# Altium schematic sheet Output-Connectors.SchDoc
size A
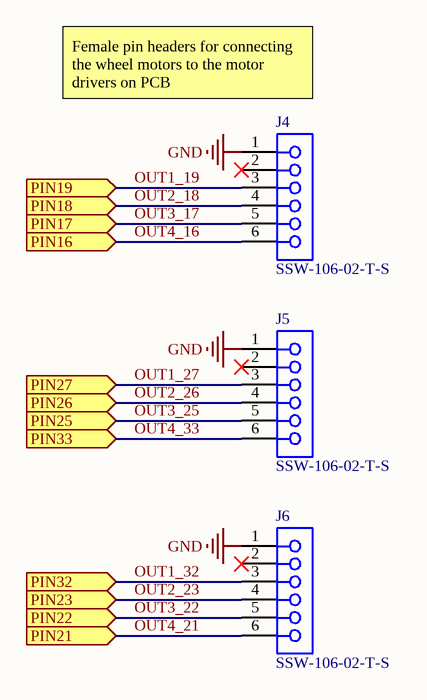
[diagram p0: Output-Connectors.SchDoc]

## Parts
J4  SSW-106-02-T-S  [SMTC-SSW-106-02-X-S]
J5  SSW-106-02-T-S  [SMTC-SSW-106-02-X-S]
J6  SSW-106-02-T-S  [SMTC-SSW-106-02-X-S]

## Ports
PIN16 (in), PIN17 (in), PIN18 (in), PIN19 (in), PIN21 (in), PIN22 (in), PIN23 (in), PIN25 (in), PIN26 (in), PIN27 (in), PIN32 (in), PIN33 (in)

## Nets
GND: J4.1 J5.1 J6.1
OUT1_19: J4.3 ; port PIN19
OUT1_27: J5.3 ; port PIN27
OUT1_32: J6.3 ; port PIN32
OUT2_18: J4.4 ; port PIN18
OUT2_23: J6.4 ; port PIN23
OUT2_26: J5.4 ; port PIN26
OUT3_17: J4.5 ; port PIN17
OUT3_22: J6.5 ; port PIN22
OUT3_25: J5.5 ; port PIN25
OUT4_16: J4.6 ; port PIN16
OUT4_21: J6.6 ; port PIN21
OUT4_33: J5.6 ; port PIN33

Not connected (* = marked no-connect by the designer): J4 2*; J5 2*; J6 2*

## Notes on the sheet
- (near J4) Female pin headers for connecting the wheel motors to the motor drivers on PCB

## Library data of the parts
J4-J6 = CMP-1023-00360-1: SQ Post Socket, Through-hole, Vertical, -55 to 105 degC, 2.54mm Pitch, 6-Pin, Female, RoHS; Manufacturer: Samtec; ComponentLink1URL: http://www.samtec.com; Temperature Range: -55 to 105 degC; Pitch: 2.54 mm; Mounting Technology: Through-hole; DatasheetVersion: F-214; ComponentLink1Description: Manufacturer URL; PackageVersion: CA, 6/1987; ComponentLink3Description: Package Specification; PackageDescription: Assembly, Socket Strip .016 X .031 Tail; ComponentLink2Description: Datasheet; ComponentLink2URL: http://www.samtec.com/documents/webfiles/pdf/SSW_TH.PDF; PackageReference: SSW-106-02-X-S; ComponentLink3URL: http://www.samtec.com/documents/webfiles/cpdf/SSW-1XX-XX-XXX-X-XX-XXX-XX-MKT.pdf; RoHS: True; PartNumber: SSW-106-02-T-S; Orientation: Vertical